# EAGLE design AdukiPlus (EAGLE 6.2)
REVISION: 1.0
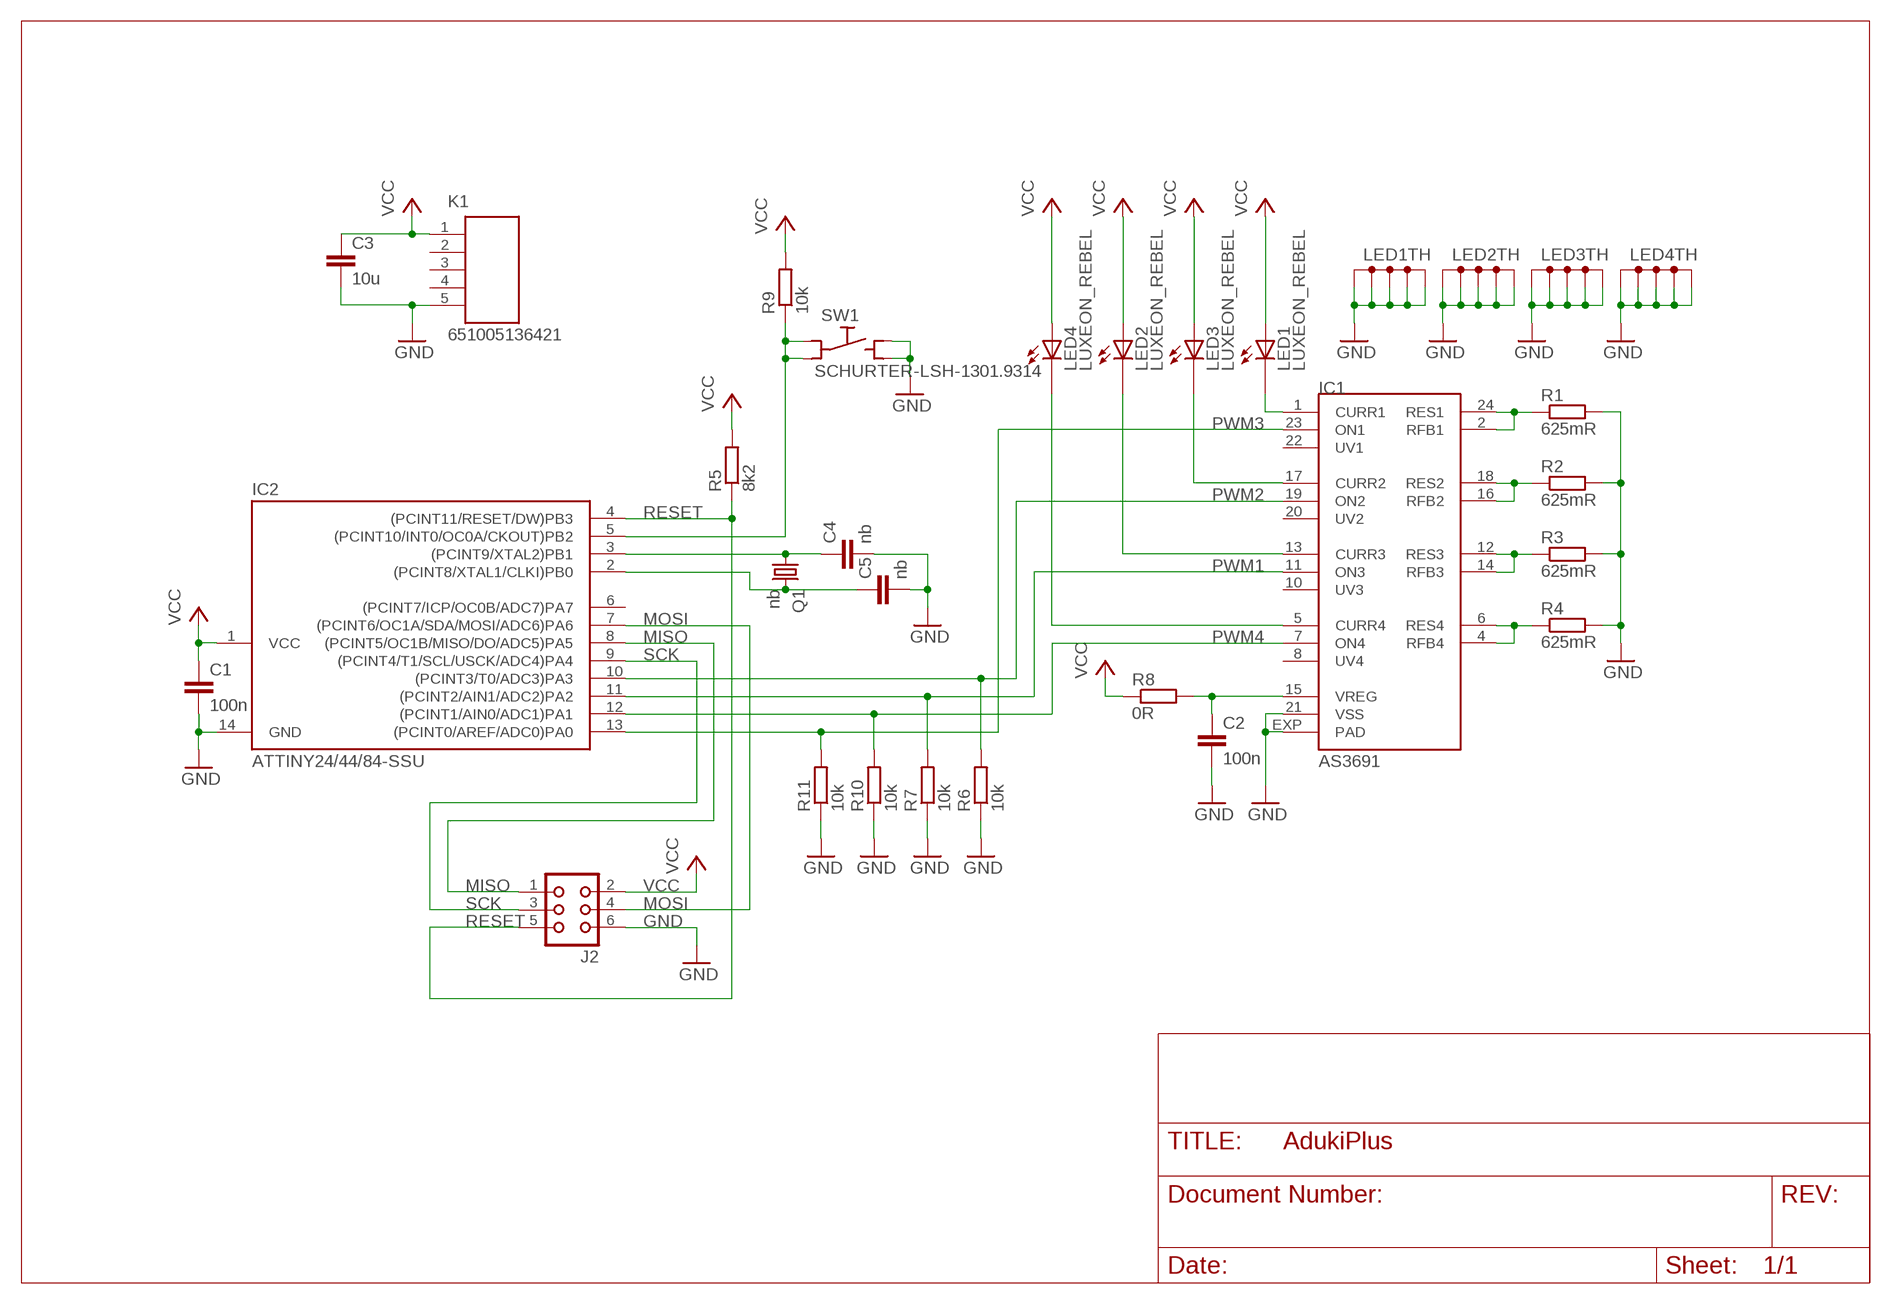
[diagram p0: schematic, sheet 1]

## Parts
C1  100n  C-EUC0603  [C0603]
C2  100n  C-EUC0603  [C0603]
C3  10u  C-EUC0603  [C0603]
C4  nb  C-EUC0603  [C0603]
C5  nb  C-EUC0603  [C0603]
IC1  AS3691  [QFN24-4X4]
IC2  ATTINY24/44/84-SSU  [SOIC14]
J2  CON06  [CON06]
K1  651005136421  [651005136421]
LED1  LUXEON_REBEL  [LUXEON_REBEL]
LED2  LUXEON_REBEL  [LUXEON_REBEL]
LED3  LUXEON_REBEL  [LUXEON_REBEL]
LED4  LUXEON_REBEL  [LUXEON_REBEL]
Q1  nb  QUARZ  [32X25]
R1  625mR  R-EU_R0603  [R0603]
R2  625mR  R-EU_R0603  [R0603]
R3  625mR  R-EU_R0603  [R0603]
R4  625mR  R-EU_R0603  [R0603]
R5  8k2  R-EU_R0603  [R0603]
R6  10k  R-EU_R0603  [R0603]
R7  10k  R-EU_R0603  [R0603]
R8  0R  R-EU_R0603  [R0603]
R9  10k  R-EU_R0603  [R0603]
R10  10k  R-EU_R0603  [R0603]
R11  10k  R-EU_R0603  [R0603]
SW1  SCHURTER-LSH-1301.9314  [LSH]

## Nets
GND: C1.2 C2.2 C3.2 C4.2 C5.2 IC1.21(VSS) IC1.EXP(PAD) IC2.14(GND) J2.6 K1.5 LED1.TH LED1.TH@1(TH) LED1.TH@2(TH) LED1.TH@3(TH) LED1.TH@4(TH) LED2.TH LED2.TH@1(TH) LED2.TH@2(TH) LED2.TH@3(TH) LED2.TH@4(TH) LED3.TH LED3.TH@1(TH) LED3.TH@2(TH) LED3.TH@3(TH) LED3.TH@4(TH) LED4.TH LED4.TH@1(TH) LED4.TH@2(TH) LED4.TH@3(TH) LED4.TH@4(TH) R1.2 R2.2 R3.2 R4.2 R6.1 R7.1 R10.1 R11.1 SW1.NO1(NO) SW1.NO2(NO)
MISO: IC2.8((PCINT5/OC1B/MISO/DO/ADC5)PA5) J2.1
MOSI: IC2.7((PCINT6/OC1A/SDA/MOSI/ADC6)PA6) J2.4
N$1: IC1.2(RFB1) IC1.24(RES1) R1.1
N$2: IC1.16(RFB2) IC1.18(RES2) R2.1
N$3: IC1.12(RES3) IC1.14(RFB3) R3.1
N$4: IC1.4(RFB4) IC1.6(RES4) R4.1
N$5: IC1.1(CURR1) LED1.C
N$6: IC1.13(CURR3) LED2.C
N$7: IC1.17(CURR2) LED3.C
N$8: IC1.5(CURR4) LED4.C
N$9: IC2.5((PCINT10/INT0/OC0A/CKOUT)PB2) R9.1 SW1.C1(C) SW1.C2(C)
N$10: C2.1 IC1.15(VREG) R8.2
N$11: C4.1 IC2.3((PCINT9/XTAL2)PB1) Q1.1
N$12: C5.1 IC2.2((PCINT8/XTAL1/CLKI)PB0) Q1.3
PWM1: IC1.11(ON3) IC2.11((PCINT2/AIN1/ADC2)PA2) R7.2
PWM2: IC1.19(ON2) IC2.10((PCINT3/T0/ADC3)PA3) R6.2
PWM3: IC1.23(ON1) IC2.13((PCINT0/AREF/ADC0)PA0) R11.2
PWM4: IC1.7(ON4) IC2.12((PCINT1/AIN0/ADC1)PA1) R10.2
RESET: IC2.4((PCINT11/RESET/DW)PB3) J2.5 R5.1
SCK: IC2.9((PCINT4/T1/SCL/USCK/ADC4)PA4) J2.3
VCC: C1.1 C3.1 IC2.1(VCC) J2.2 K1.1 LED1.A LED2.A LED3.A LED4.A R5.2 R8.1 R9.2
Unconnected: IC1.8(UV4) IC1.10(UV3) IC1.20(UV2) IC1.22(UV1) IC2.6((PCINT7/ICP/OC0B/ADC7)PA7) K1.2 K1.3 K1.4 LED1.A@1(A) LED1.C@1(C) LED2.A@1(A) LED2.C@1(C) LED3.A@1(A) LED3.C@1(C) LED4.A@1(A) LED4.C@1(C)

## Library data of the parts
C1-C5 = rcl:C-EU: CAPACITOR, European symbol
IC1 = ams:AS3691: Austria Microsystems AS3691
IC2 = attiny24_44_84:ATTINY24/44/84
J2 = con-harting:CON06: CONNECTOR; OC_FARNELL: unknown; OC_NEWARK: unknown
K1 = Wuerth_Elektronik_eiCan_11_Communication_Connectors_2_3:651005136421: WR-COM Vertical 5 Contacts Mini USB Type B, 5 pins
LED1-LED4 = led-lumiled:LUXEON_REBEL: LUXEON Rebel Display layer 93, Pins, and connect all contact points with a net. The thermal pads are defined in a separate gate with addlevel REQUEST. Draw a net named 'TH' and connect all thermal pads with it. Please read the Package's Description about DRC settings. Source: http://www.lumileds.com/pdfs/AB32.pdf
Q1 = quarze:QUARZ
R1-R11 = rcl:R-EU_: RESISTOR, European symbol
SW1 = _schurter_LPH_LPS_LSH_SMS:SCHURTER-LSH-*: Schurter LSH Printmount Switches, Gullwing Leads [SMT] Momentary Action: Normally Open (NO) (6.0 x 6.0)mm Body Dim. Note: using same package drawing for actuator diam. (3.00 … 3.40)mm Source: www.schurter.com Actuator Diam. mm / Overall Height mm / Schurter # -------------------------------------------------------------- 3.40 / 04.30 / 1301.9314.xx 3.40 / 05.00 / 1301.9315.xx 3.20 / 07.00 / 1301.9316.xx 3.30 / 07.30 / 1301.9317.xx 3.10 / 08.00 / 1301.9319.xx 3.00 / 12.50 / 1301.9320.xx xx: denotes packaging, see Schurter data sheets Author: Dipl.-Ing. FH Rainer Bayer Hochschule Heilbronn HHN: rainer.bayer@hs-heilbronn.de − http://www.hs-heilbronn.de/rainer.bayer Ingenieurbüro ing-rb: mail@ing-rb.de − http://www.ing-rb.de/

## Board
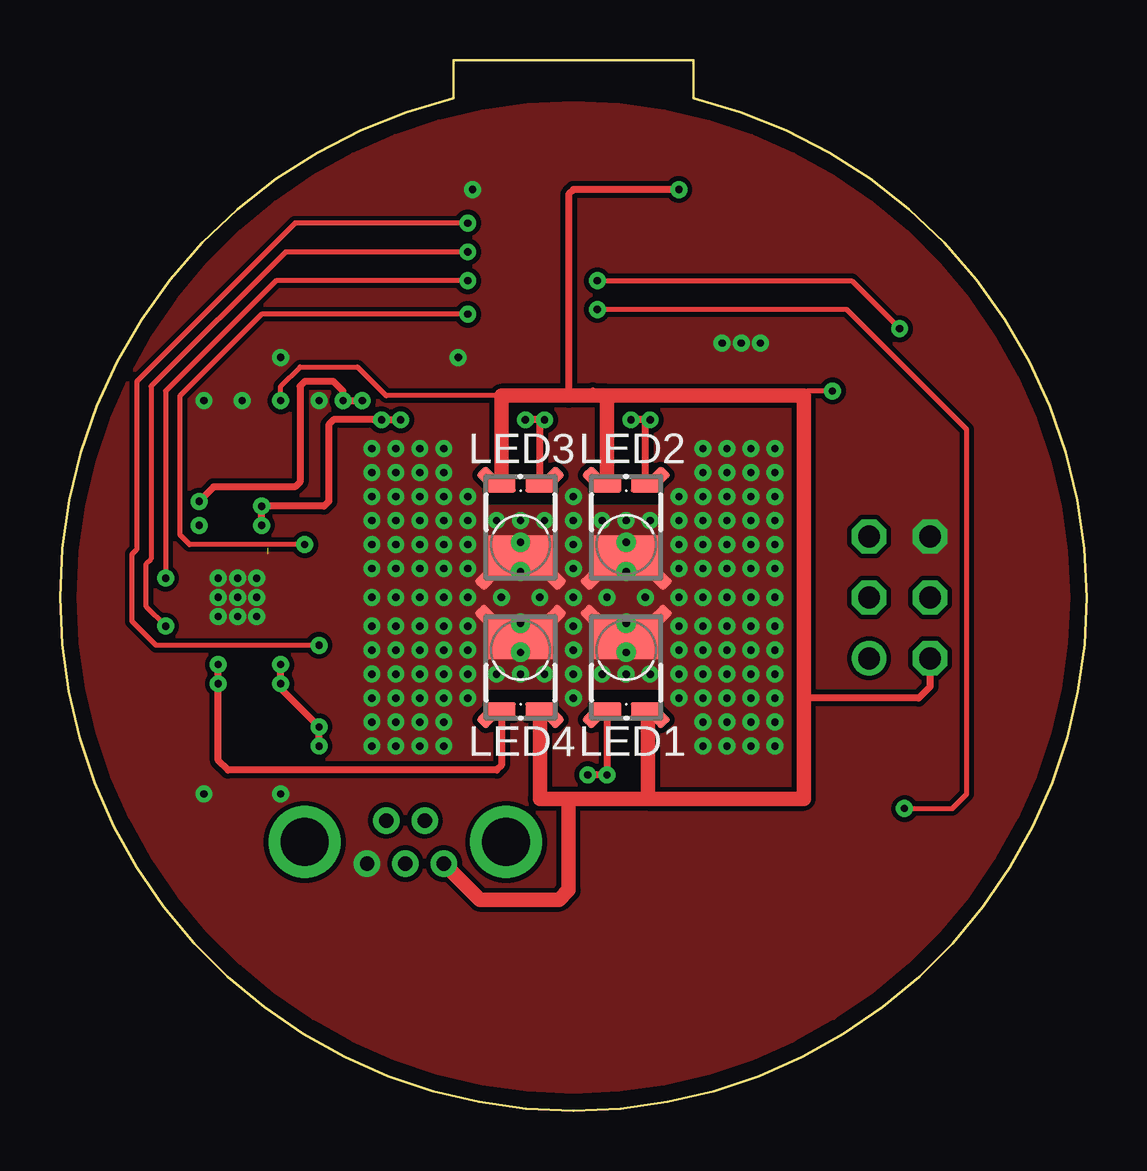
[diagram p1: board, top side]
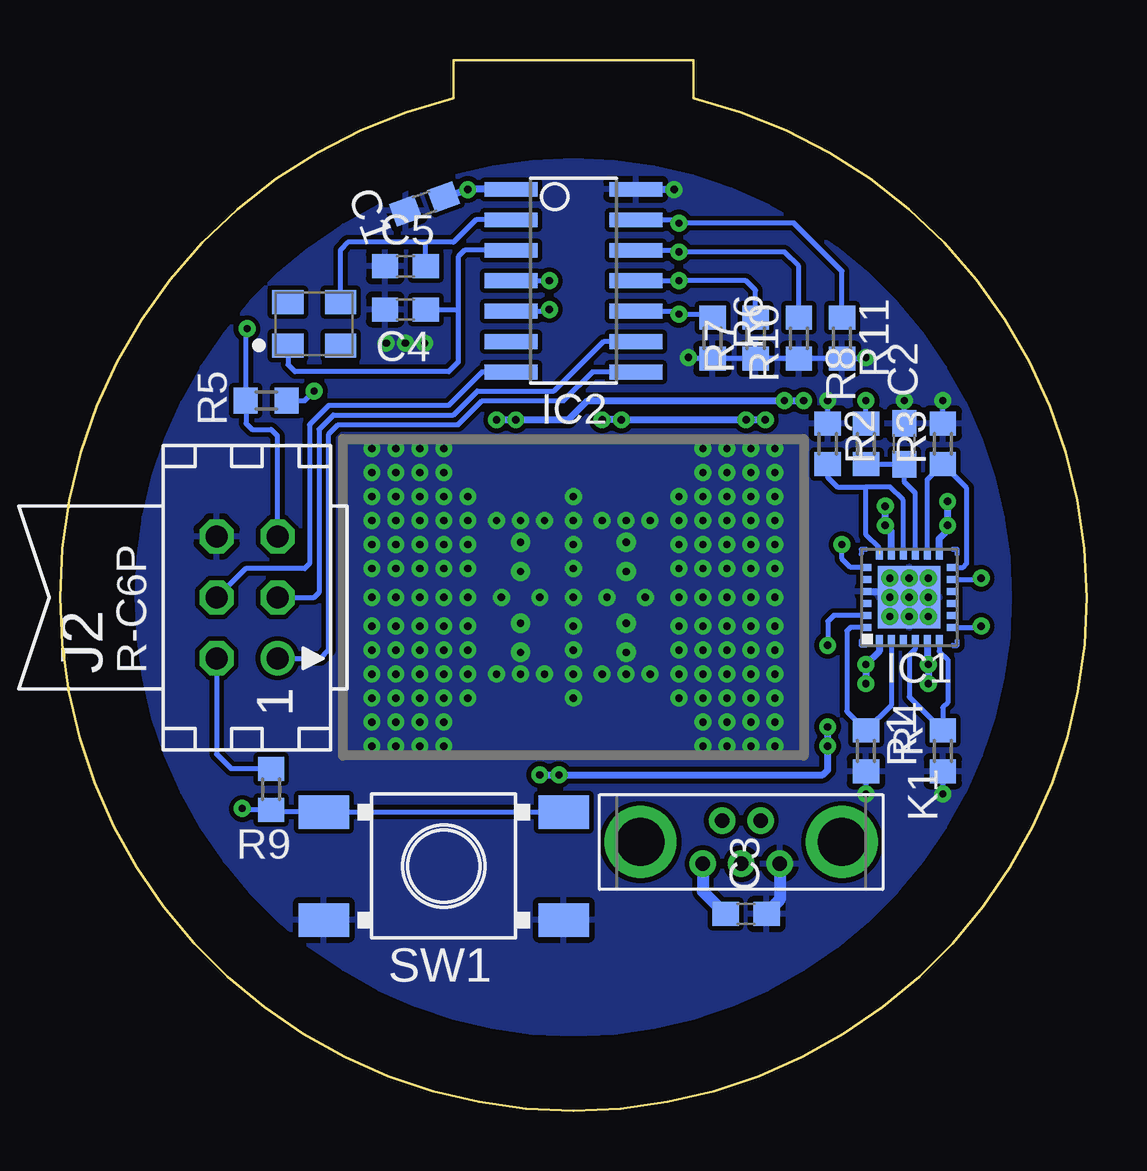
[diagram p2: board, bottom side, seen from below]

Size 42.8 x 43.8 mm. Coordinates in mm from the lower left corner, seen from the top.
Outline: 16.4,43.8 16.4,42.2 arc76 0,21.4 arc90 21.4,0 arc90 42.8,21.4 arc76 26.4,42.2 26.4,43.8 16.4,43.8
Copper layers (1*16): Top 0.035mm / dielectric 1.5mm / Bottom 0.035mm
Design rules: minimum track width 0.2mm, minimum drill 0.3mm, track to track 0.2mm, track to pad 0.2mm, pad to pad 0.2mm, via to via 0.2mm, smd to smd 0mil, copper to edge 0.3mm, drill to drill 8mil, minimum pad ring 10mil, minimum via ring 8mil, stop-mask expansion 4mil, vias tented up to drill 0.3mm, thermal gap 10mil
tKeepout: area 0.3,0.3 to 42.5,42.5
bKeepout: area 1.4,1.4 to 41.3,41.3
vRestrict: area 1.4,1.4 to 41.3,41.3

### Footprints (pad centres in the part's own frame; a part is rotated, then mirrored left to right if it is on the bottom)
C0603 = smd 1.1 x 1: 1 -0.85,0; 2 0.85,0
QFN24-4X4 = smd 0.45 x 0.3: 1 -1.8,1.25; 2 -1.8,0.75; 3 -1.8,0.25; 4 -1.8,-0.25; 5 -1.8,-0.75; 6 -1.8,-1.25; 13 1.8,-1.25; 14 1.8,-0.75; 15 1.8,-0.25; 16 1.8,0.25; 17 1.8,0.75; 18 1.8,1.25 | smd 0.3 x 0.45: 7 -1.25,-1.8; 8 -0.75,-1.8; 9 -0.25,-1.8; 10 0.25,-1.8; 11 0.75,-1.8; 12 1.25,-1.8; 19 1.25,1.8; 20 0.75,1.8; 21 0.25,1.8; 22 -0.25,1.8; 23 -0.75,1.8; 24 -1.25,1.8 | smd 2.6 x 2.6: EXP 0,0
SOIC14 = smd 0.61 x 2.21: 1 -3.81,-2.603; 2 -2.54,-2.603; 3 -1.27,-2.603; 4 0,-2.603; 5 1.27,-2.603; 6 2.54,-2.603; 7 3.81,-2.603; 8 3.81,2.603; 9 2.54,2.603; 10 1.27,2.603; 11 0,2.603; 12 -1.27,2.603; 13 -2.54,2.603; 14 -3.81,2.603
CON06 = drill 0.914: 1 -2.54,-1.27 | drill 0.914 octagon: 2 -2.54,1.27; 3 0,-1.27; 4 0,1.27; 5 2.54,-1.27; 6 2.54,1.27
651005136421 = drill 0.6: 1 0.9,-1.6; 2 -0.9,-0.8; 3 0.9,0; 4 -0.9,0.8; 5 0.9,1.6 | drill 2: Z1 0,4.2; Z2 0,-4.2
LUXEON_REBEL = smd 1.2 x 0.67: A 0.8,-2.51; C -0.8,-2.51 | smd 1 x 0.6 rotated 315: A@1 1.31,-2.75 | smd 1 x 0.6 rotated 225: C@1 -1.31,-2.75 | smd 2.8 x 1.77: TH 0,0.51 | smd 1 x 0.6 rotated 135: TH@1 -1.39,1.39 | smd 1 x 0.6 rotated 45: TH@2 1.39,1.39 | drill 0.3 pad 0.4: TH@3 0,-0.095; TH@4 0,1.125
32X25 = smd 1.3 x 1: 1 -1.1,-0.9; 2 1.1,-0.9; 3 1.1,0.9; 4 -1.1,0.9
R0603 = smd 1 x 1.1: 1 -0.85,0; 2 0.85,0
LSH = smd 2.1 x 1.4: C1 -5,-2.25; C2 5,-2.25; NO1 -5,2.25; NO2 5,2.25

### Placement (x,y rotation side)
C1  27.6,37.8 200 bottom
C2  7.6,27.8 90 bottom
C3  14.2,8.2 0 bottom
C4  28.4,33.4 180 bottom
C5  28.4,35.2 180 bottom
IC1  7.4,21.4 90 bottom
IC2  21.4,34.6 270 bottom
J2  35,21.4 90 bottom
K1  14.4,11.2 270 bottom
LED1  23.6,19.2 0 top
LED2  23.6,23.6 180 top
LED3  19.2,23.6 180 top
LED4  19.2,19.2 0 top
Q1  32.2,32.8 0 bottom
R1  9.2,15 270 bottom
R2  10.8,27.8 90 bottom
R3  6,27.8 90 bottom
R4  6,15 270 bottom
R5  34.2,29.6 0 bottom
R6  15.6,32.2 90 bottom
R7  13.8,32.2 90 bottom
R8  9.2,27.8 270 bottom
R9  34,13.4 90 bottom
R10  12,32.2 90 bottom
R11  10.2,32.2 90 bottom
SW1  26.8,10.2 180 bottom

### Tracks (layer width: path | path; a pad name or v marks a point on that pad's centre or on a via)
GND  (via drill 0.3, 0.3 pad 0.3)
  Bottom 0.2: R3.2 v6,29.6 | C2.2 v7.6,29.6 | R2.2 v10.8,29.6 | v16.6,31.4 16.55,31.35 R6.1 R7.1 R10.1 R11.1 9.25,31.35 v9.2,31.4 | R4.2 v6,13.2 | R1.2 v9.2,13.2
  Bottom 0.3: IC1.21 7.65,21.65 IC1.EXP | IC2.14 v17.21,38.41 v17.2,38.4
  Bottom 0.5: K1.5 12.8,8.8 13.4,8.2
  other vias: 17,23.6 18.2,24.6 17,24.6 19.2,24.6 20.2,24.6 21.4,24.6 21.4,23.6 21.4,22.6 21.4,21.4 21.4,20.2 21.4,19.2 21.4,18.2 21.4,17.2 21.4,25.6 17,25.6 25.8,25.6 25.8,24.6 25.8,23.6 25.8,22.6 17,22.6 25.8,20.2 25.8,19.2 25.8,18.2 17,20.2 17,19.2 17,18.2 17,17.2 18.4,21.4 20,21.4 22.8,21.4 24.4,21.4 17,21.4 25.8,21.4 23.6,24.6 22.6,24.6 24.6,24.6 19.2,18.2 18.2,18.2 20.2,18.2 23.6,18.2 22.6,18.2 24.6,18.2 26.8,25.6 26.8,24.6 26.8,23.6 26.8,22.6 26.8,21.4 26.8,20.2 26.8,19.2 26.8,18.2 16,18.2 16,19.2 16,17.2 16,20.2 16,21.4 16,22.6 16,23.6 16,24.6 16,25.6 15,17.2 15,18.2 15,19.2 15,20.2 15,21.4 15,22.6 15,23.6 15,24.6 15,25.6 27.8,25.6 26.8,26.6 27.8,26.6 27.8,24.6 27.8,23.6 27.8,22.6 27.8,21.4 27.8,20.2 27.8,19.2 27.8,18.2 16,26.6 15,26.6 16,16.2 15,16.2 14,26.6 14,25.6 14,24.6 14,23.6 14,22.6 14,21.4 14,20.2 14,19.2 14,18.2 14,17.2 14,16.2 28.8,26.6 28.8,25.6 28.8,24.6 28.8,23.6 28.8,22.6 28.8,21.4 28.8,20.2 28.8,19.2 28.8,18.2 13,26.6 13,25.6 13,24.6 13,23.6 13,22.6 13,21.4 13,20.2 13,19.2 13,18.2 13,17.2 13,16.2 25.8,17.2 26.8,17.2 27.8,17.2 28.8,17.2 26.8,16.2 27.8,16.2 28.8,16.2 29.8,16.2 29.8,17.2 29.8,26.6 29.8,25.6 29.8,24.6 29.8,23.6 29.8,22.6 29.8,21.4 29.8,20.2 29.8,19.2 29.8,18.2 16,27.6 15,27.6 14,27.6 13,27.6 29.8,27.6 28.8,27.6 27.8,27.6 26.8,27.6 29.8,15.2 28.8,15.2 27.8,15.2 26.8,15.2 16,15.2 15,15.2 14,15.2 13,15.2 7.4,21.4 6.6,22.2 7.4,22.2 8.2,22.2 8.2,21.4 6.6,21.4 6.6,20.6 7.4,20.6 8.2,20.6 27.6,32 28.4,32 29.2,32
  pour Top (no thermals): 21.4,42 arc-90 42,21.4 arc-90 21.4,0.8 arc-90 0.8,21.4 arc-90
  pour Bottom: 3.2,21.4 arc-90 21.4,39.6 arc-90 39.6,21.4 arc-90 21.4,3.2 arc-90
MISO
  Bottom 0.2: IC2.8 20.61,30.79 21.8,29.6 25.2,29.6 26.2,28.6 31.2,28.6 31.6,28.2 31.6,19.2 31.94,18.86 J2.1
MOSI
  Bottom 0.2: 24.01,30.8 IC2.7 25.21,30.79 26.6,29.4 31.6,29.4 32.4,28.6 32.4,22.8 32.6,22.6 35.07,22.6 J2.4
N$1
  Bottom 0.2: IC1.2 8.15,16.9 R1.1 10,16.65 10,20 9.85,20.15 IC1.24
N$2  (1 unrouted)
  Bottom 0.2: IC1.16 7.65,25.45 8.2,26 9.2,26 | 8.65,23.45 9.2,24 9.2,26 | 9.2,26 10.4,26 10.8,26.4 R2.1
N$3
  Bottom 0.2: IC1.14 6.65,26.3 R3.1 5,25.95 5,22.8 5.15,22.65 IC1.12
N$4
  Bottom 0.2: IC1.6 6.15,19.15 5.8,18.8 5.8,17 6,16.8 R4.1 7.4,17.25 7.4,19 7.15,19.25 IC1.4
N$5  (via drill 0.3, 0.3 pad 0.3)
  Top 0.3: LED1.C v22.8,14 v22,14 | v10.8,15.2 v10.8,16 9.2,17.6 v9.2,17.8 v9.2,18.6
  Bottom 0.3: v22.8,14 v22,14 11,14 10.8,14.2 v10.8,15.2 v10.8,16 | IC1.1 8.65,19.15 v9.2,18.6 v9.2,17.8
N$6  (via drill 0.3 pad 0.3)
  Top 0.3: LED2.C 24.4,28.8 | 24.4,28.8 v23.8,28.8 | 24.4,28.8 v24.6,28.8 | v5.8,25.4 6.4,26 9.8,26 10,26.2 10,30.2 10.2,30.4 11.4,30.4 11.8,30 v11.8,29.6 v12.6,29.6
  Bottom 0.3: IC1.13 6.15,23.85 5.8,24.2 v5.8,24.4 v5.8,25.4 | v24.6,28.8 v23.8,28.8 21.6,28.8 20.8,29.6 v12.6,29.6 v11.8,29.6
N$7  (via drill 0.3 pad 0.3)
  Top 0.3: LED3.C 20,28.8 | 20,28.8 v20.2,28.8 | 20,28.8 v19.4,28.8 | v14.2,28.8 v13.4,28.8 11.4,28.8 11.2,28.6 11.2,25.4 11,25.2 v8.4,25.2 v8.4,24.4
  Bottom 0.3: IC1.17 8.15,24.15 v8.4,24.4 v8.4,25.2 | v13.4,28.8 v14.2,28.8 v19.4,28.8 v20.2,28.8
N$8  (via drill 0.3)
  Top 0.3: LED4.C 18.4,14.4 18.2,14.2 7,14.2 6.6,14.6 v6.6,17.8 v6.6,18.6
  Bottom 0.3: IC1.5 6.65,18.85 6.6,18.8 v6.6,18.6 v6.6,17.8
N$9  (via drill 0.3)
  Top 0.2: v35.2,12.6 37.2,12.6 37.8,13.2 37.8,28.4 32.8,33.4 v22.4,33.4
  Bottom 0.2: SW1.C1 SW1.C2 33.9,12.45 R9.1 35.15,12.55 v35.2,12.6 | IC2.5 22.47,33.33 v22.4,33.4
N$10
  Bottom 0.2: R8.2 C2.1 7.6,26.2 7.15,25.75 IC1.15
N$11
  Bottom 0.2: IC2.3 25.93,35.87 26.2,35.6 26.2,33.4 | 26.2,33.4 26.2,31.2 26.6,30.8 33,30.8 33.3,31.1 Q1.1 | C4.1 26.2,33.4
N$12
  Bottom 0.2: IC2.2 25.46,37.14 26.4,36.2 27.6,36.2 | 27.6,36.2 30.8,36.2 31.1,35.9 Q1.3 | C5.1 27.55,36.15 27.6,36.2
PWM1  (via drill 0.3 pad 0.3)
  Top 0.2: v17,34.6 9,34.6 4.4,30 v4.4,22.2
  Bottom 0.2: IC1.11 4.45,22.15 v4.4,22.2 | IC2.11 v17,34.6 14.2,34.6 13.8,34.2 R7.2
PWM2  (via drill 0.3 pad 0.3)
  Top 0.2: v10.2,23.6 5.4,23.6 5,24 5,29.8 8.4,33.2 v17,33.2
  Bottom 0.2: IC1.19 9.85,22.65 10.2,23 v10.2,23.6 | IC2.10 17.13,33.33 v17,33.2 15.75,33.2 R6.2
PWM3  (via drill 0.3 pad 0.3)
  Top 0.2: v10.8,19.4 4,19.4 3,20.4 3,23.2 3.2,23.4 3.2,30.4 9.8,37 v17,37
  Bottom 0.2: IC1.23 10.55,20.65 10.8,20.4 v10.8,19.4 | IC2.13 17.14,37.14 v17,37 12.2,37 10.2,35 R11.2
PWM4  (via drill 0.3 pad 0.3)
  Top 0.2: v4.4,20.2 3.6,21 3.6,22.8 3.8,23 3.8,30.2 9.4,35.8 v17,35.8
  Bottom 0.2: IC1.7 4.45,20.15 v4.4,20.2 | IC2.12 17.07,35.87 v17,35.8 12.6,35.8 12,35.2 R10.2
RESET  (via drill 0.3)
  Top 0.2: v22.4,34.6 33,34.6 v35,32.6
  Bottom 0.2: IC2.4 v22.4,34.6 | J2.5 33.73,28.13 34,28.4 34.8,28.4 35.05,28.65 R5.1 35.05,32.55 v35,32.6
SCK
  Bottom 0.2: IC2.9 20.14,32.06 22.2,30 25.4,30 26.4,29 31.4,29 32,28.4 32,21.6 32.2,21.4 J2.3
VCC  (via drill 0.3)
  Top 0.2: 18.4,29.8 13.6,29.8 12.4,31 10,31 9.2,30.2 v9.2,29.6 | v32.2,30 31.2,30 arc90 31,29.8
  Top 0.25: LED1.A 24.51,16.6
  Top 0.3: 25.2,29.8 25,29.8 | 22.2,30 22.4,29.8 | J2.2 36.27,17.67 35.8,17.2 31,17.2 | v25.8,38.4 21.4,38.4 21.2,38.2 21.2,29.8
  Top 0.6: 24.51,16.6 24.51,13 | LED4.A 20,13 21.2,13 | LED3.A 18.4,29.8 21.2,29.8 22.4,29.8 22.8,29.8 | LED2.A 22.8,29.8 | 24.51,13 21.2,13 | 24.51,13 31,13 31,17.2 31,29.8 25,29.8 22.8,29.8 | 21.2,13 21.2,9.2 20.8,8.8 17.5,8.8 K1.1
  Bottom 0.2: R8.1 v9.2,29.6 | J2.2 36.27,14.87 35.65,14.25 R9.2 | R5.2 32.6,29.6 v32.2,30
  Bottom 0.3: 24.01,38.4 IC2.1 v25.79,38.41 | v25.79,38.41 v25.8,38.4 | C1.1 v25.79,38.41
  Bottom 0.5: K1.1 16,9.15 C3.1